# Altium project ADCAN.PrjPCB
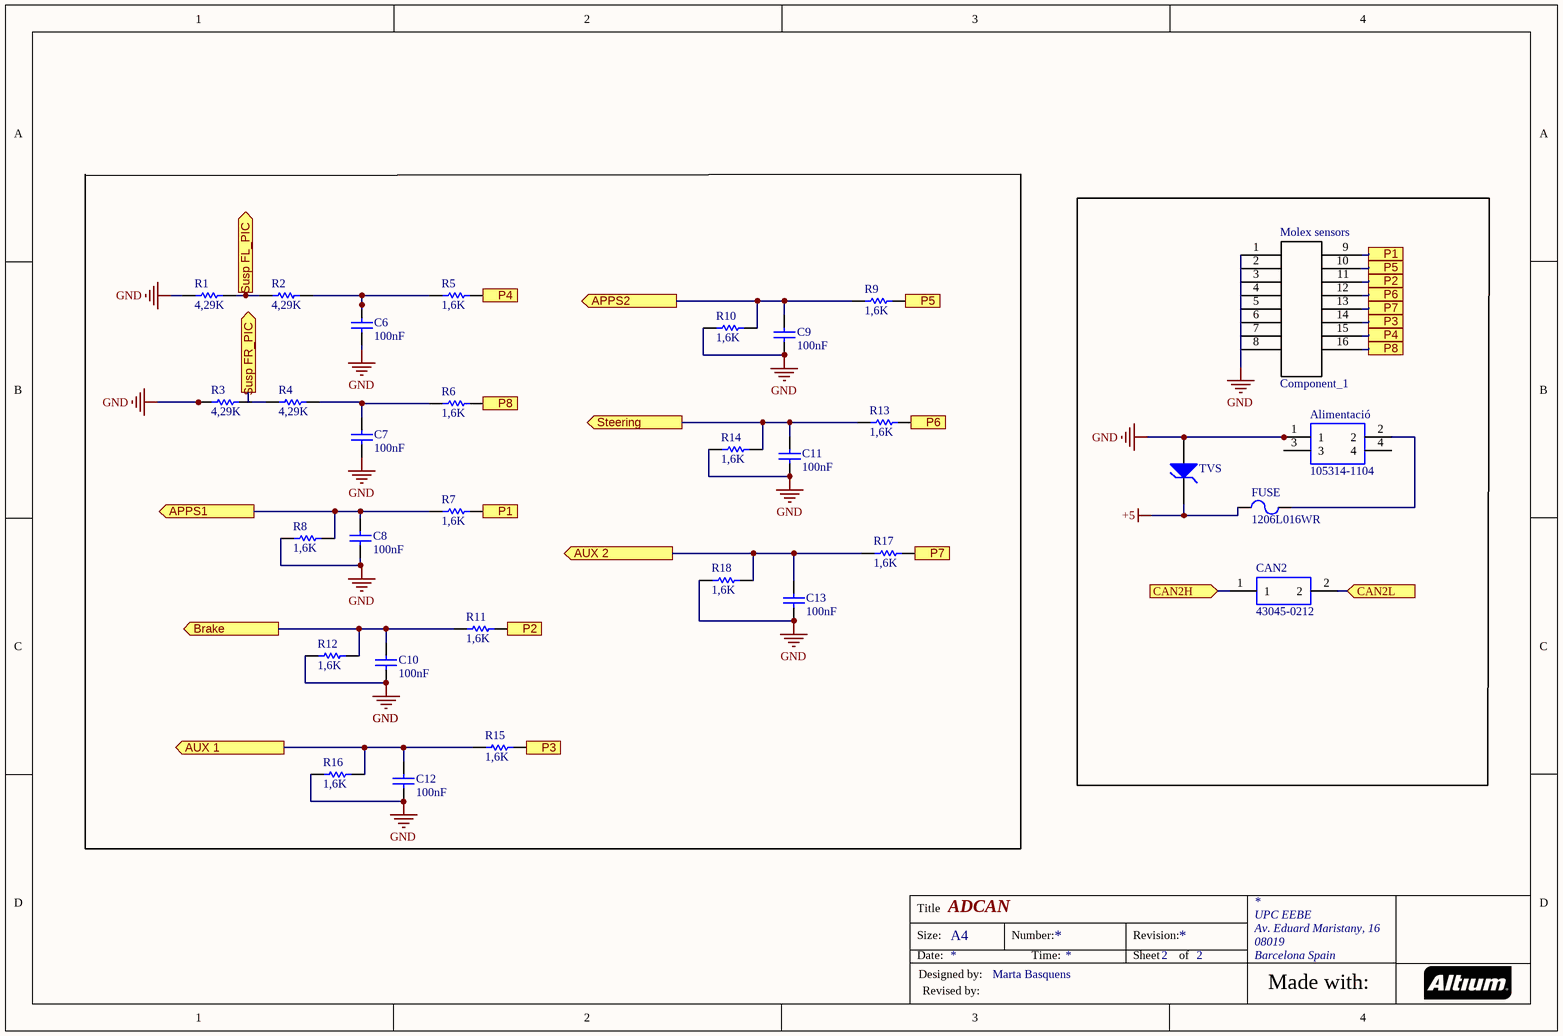
[diagram p0: ADCAN_[sch2].SchDoc]
2 sheets, 50 parts. Net scope: flat (ports and power ports of the same name join across sheets).
Board file: ADCAN.PcbDoc
Sheets:
  ADCAN_[sch2].SchDoc
  ADCAN_[sch1].SchDoc

## Sheet ADCAN_[sch2].SchDoc: ADCAN
size A4; SheetNumber: 2; SheetTotal: 2; University: UPC EEBE; City&Country: Barcelona Spain; Country: NSW; CP: 08019; DesignerName: Marta Basquens; Address: Av. Eduard Maristany, 16

### Parts
Alimentació  105314-1104  [1053141304]
C6  100nF  [CAPC3216X102X94LL20]
C7  100nF  [CAPC3216X102X94LL20]
C8  100nF  [CAPC3216X102X94LL20]
C9  100nF  [CAPC3216X102X94LL20]
C10  100nF  [CAPC3216X102X94LL20]
C11  100nF  [CAPC3216X102X94LL20]
C12  100nF  [CAPC3216X102X94LL20]
C13  100nF  [CAPC3216X102X94LL20]
CAN2  43045-0212  [0430450212]
FUSE  1206L016WR  [LFUS-1206L016WR_V]
Molex_sensors  Component_1  [PCBComponent_1]
R1  4,29K  [RESC1206(3216)_L]
R2  4,29K  [RESC1206(3216)_L]
R3  4,29K  [RESC1206(3216)_L]
R4  4,29K  [RESC1206(3216)_L]
R5  1,6K  [RESC1206(3216)_L]
R6  1,6K  [RESC1206(3216)_L]
R7  1,6K  [RESC1206(3216)_L]
R8  1,6K  [RESC1206(3216)_L]
R9  1,6K  [RESC1206(3216)_L]
R10  1,6K  [RESC1206(3216)_L]
R11  1,6K  [RESC1206(3216)_L]
R12  1,6K  [RESC1206(3216)_L]
R13  1,6K  [RESC1206(3216)_L]
R14  1,6K  [RESC1206(3216)_L]
R15  1,6K  [RESC1206(3216)_L]
R16  1,6K  [RESC1206(3216)_L]
R17  1,6K  [RESC1206(3216)_L]
R18  1,6K  [RESC1206(3216)_L]
TVS  (no value)  [ONSC-SMB-2-403A-03_J_V]

### Ports
APPS1 (out), APPS2 (out), AUX 1 (out), AUX 2 (out), Brake (out), CAN2H (in), CAN2L (in), P1, P2, P3, P4, P5, P6, P7, P8, Steering (out), Susp FL_PIC (out), Susp FR_PIC (out)

### Nets
+5: FUSE.1 TVS.C
GND: Alimentació.1 C6.1 C7.1 C8.1 C9.1 C10.1 C11.1 C12.1 C13.1 R1.1 R3.1 R8.2 R10.2 R12.2 R14.2 R16.2 R18.2 TVS.A
NetAlimentació_2: Alimentació.2 FUSE.2
NetC6_2: C6.2 R2.2 R5.2
NetC7_2: C7.2 R4.2 R6.2
NetC8_2: C8.2 R7.2 R8.1 ; port APPS1
NetC9_2: C9.2 R9.2 R10.1 ; port APPS2
NetC10_2: C10.2 R11.2 R12.1 ; port Brake
NetC11_2: C11.2 R13.2 R14.1 ; port Steering
NetC12_2: C12.2 R15.2 R16.1 ; port AUX 1
NetC13_2: C13.2 R17.2 R18.1 ; port AUX 2
NetCAN2_1: CAN2.1 ; port CAN2H
NetCAN2_2: CAN2.2 ; port CAN2L
NetPIC18F2685_22: R1.2 R2.1 ; port Susp FL_PIC
NetR3_1: R3.1 R4.2
NetR5_1: R5.1 ; port P4
NetR6_1: R6.1 ; port P8
NetR7_1: R7.1 ; port P1
NetR9_1: R9.1 ; port P5
NetR11_1: R11.1 ; port P2
NetR13_1: R13.1 ; port P6
NetR15_1: R15.1 ; port P3
NetR17_1: R17.1 ; port P7

Not connected (* = marked no-connect by the designer): Alimentació 3 4; Molex_sensors 1 2 3 4 5 6 7 8 9 10 11 12 13 14 15 16

### Notes on the sheet
- Title
- Size:
- Date:
- Designed by:
- A4
- Number:
- Time:
- Revision:
- Sheet
- of
- Made with:
- Revised by:

### Library data of the parts
Alimentació = 105314-1104: Molex Nano-Fit 105314, 2.5mm Pitch, 4 Way, 2 Row, Right Angle PCB Header, Through Hole; Geometry.Height: 9.14mm; Manufacturer_Name: Molex; Manufacturer_Part_Number: 105314-1104; RS Part Number: 1623690; RS Price/Stock: http://uk.rs-online.com/web/p/products/1623690; Arrow Part Number: 105314-1104; Arrow Price/Stock: http://uk.rs-online.com/web/p/products/1623690; Datasheet Link: https://www.molex.com/pdm_docs/sd/1053141104_sd.pdf
C6-C13 = CMP-2000-07385-1: Chip Capacitor, 1.05 nF, +/- 12%, 14 V, -55 to 125 degC, 1206 (3216 Metric), RoHS, Tape and Reel; Manufacturer: AVX; Brand/Series: TransGuard®; Current, Reverse, Maximum: 15 / µA; Type: TVS; Standards: ULListed; Capacitance: 1050 / pF; Energy Rating: 0.4 / Joules; Voltage, Working: 14/10 / VDC/VAC; Suppressor Type: Voltage; For Use With: IndustrialEquipment; Temperature, Junction, Maximum: +125 / °C; Configuration: Bidirectional; Current, Ratings: 150 / A; Voltage, Operating: 10/14 / VAC/VDC; Primary Type: Diodes; Voltage, Breakdown: 18.5 / V; Clamping Voltage: 32 / V; Temperature, Junction, Minimum: –55 / °C; Termination: Leadwires; Mounting Type: Thru-Hole; Current, Leakage: 15 / µA; Package Type: 1206; Current, Leakage, Maximum: 15 / µA; Manufacturer URL: http://www.avx.com/; Dimensions: 3.2Lx1.6Wx0.94T / mm; Package Reference: 1206; Datasheet URL: http://datasheets.avx.com/tguard.pdf; Current, Surge: 150 / A; Mounting Technology: SurfaceMount; Voltage, Clamping: 32 / V; Datasheet Version: 08/2016; Package Description: 2-Pin Surface Mount Device, Body 3.2 x 1.6 mm
CAN2 = 43045-0212: 2 way 2 row vertical header,3mm pitch Molex MICRO-FIT 3.0 Series, Series Number 43045, 3mm Pitch 2 Way 2 Row Shrouded Straight PCB Header, Through Hole; Allied_Number: 70090950; Manufacturer_Name: Molex; Manufacturer_Part_Number: 43045-0212; RS Part Number: 2332860P; RS Price/Stock: http://uk.rs-online.com/web/p/products/2332860P; Allied Price/Stock: https://www.alliedelec.com/molex-incorporated-43045-0212/70090950/; Arrow Part Number: 43045-0212; Arrow Price/Stock: http://uk.rs-online.com/web/p/products/2332860P; Datasheet Link: http://www.mouser.com/ds/2/276/0430450212_PCB_HEADERS-142866.pdf
FUSE = CMP-2000-05471-1: Resettable Fuse, 30 V, 100 A, 4.5 Ohm, -40 to 85 degC, 1206 (3216 Metric), RoHS, Tape and Reel; Manufacturer: Littelfuse; Hold Current [Ih]: 0.16A; Trip Current: 0.37A; Working Voltage-Max: 30V; Datasheet Version: 08/2016; Size: 1206; Manufacturer URL: http://www.littelfuse.com/; Datasheet URL: http://www.littelfuse.com/~/media/electronics/datasheets/resettable_ptcs/littelfuse_ptc_1206l_datasheet.pdf.pdf; Mounting Technology: SurfaceMount; Package Reference: 1206L016WR; Package Description: 2-Pin Surface Mount Device, Body 3.2 x 1.65 mm, Height 1.45 mm (Max); Operating Temp Range: -40to+85°C
R1-R18 = CMP-1014-00659-1: 22K 0.25W 1% 1206 (3216 Metric)  SMD; Value: 22000.00 Ohm; Case-EIA: 1206; Case-Metric: 3216; Technology: SMT; Tolerance: 1 %; Power: 0.25 W
TVS = CMP-1679-00003-1: TVS ZENER UNIDIR 600W 27V SMB; PartNumber: P6SMB27AT3G; PackageReference: SMB-2-403A-03_J; ComponentLink1URL: http://www.onsemi.com/pub_link/Collateral/P6SMB6.8AT3-D.PDF; ComponentLink1Description: Datasheet

## Sheet ADCAN_[sch1].SchDoc: ADCAN
size A4; Author: Marta Basquens; SheetNumber: 1; SheetTotal: 2; University: UPC EEBE; City&Country: Barcelona Spain; Country: NSW; CP: 08019; DesignerName: Marta Basquens; Address: Av. Eduard Maristany, 16
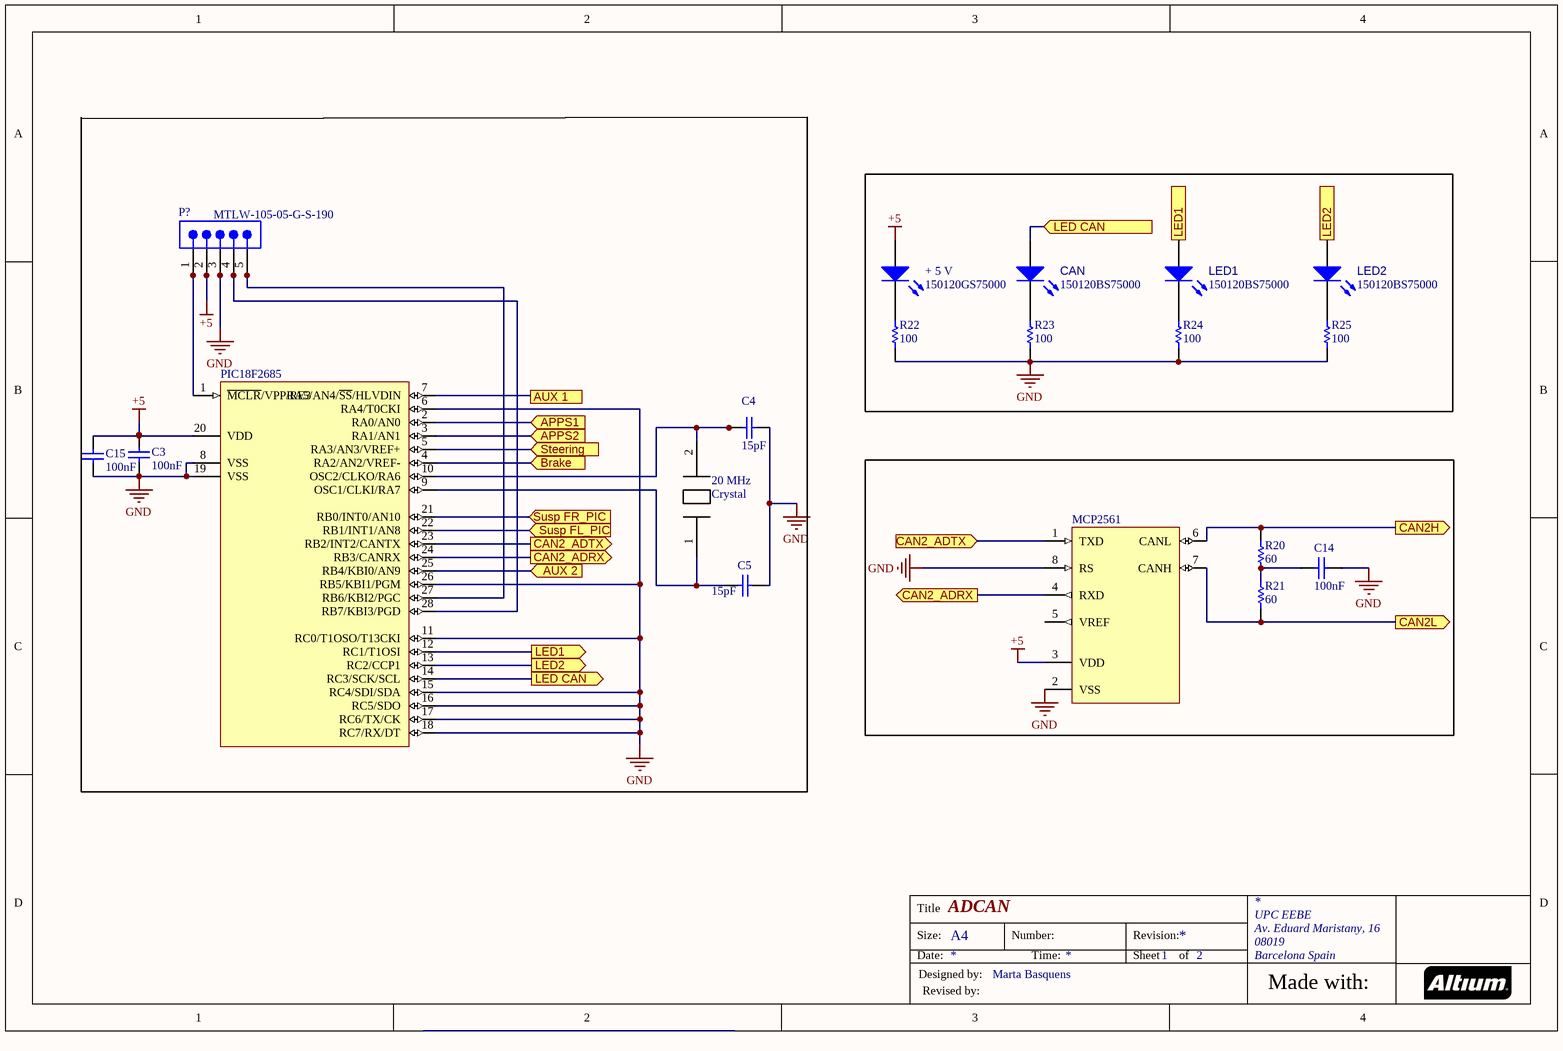
[diagram p1: ADCAN_[sch1].SchDoc]

### Parts
20_MHz  Crystal  [Crystal]
+_5_V  150120GS75000  [1206_A]
C3  100nF  [CAPC3216X102X94LL20]
C4  15pF  [CAPC1206(3216)100_L]
C5  15pF  [CAPC1206(3216)100_L]
C14  100nF  [CAPC3216X102X94LL20]
C15  100nF  [CAPC3216X102X94LL20]
CAN  150120BS75000  [1206_A]
LED1  150120BS75000  [1206_A]
LED2  150120BS75000  [1206_A]
MCP2561  (no value)  [SOIC-SN8_N]
P?  MTLW-105-05-G-S-190  [SMTC-MTLW-105-05-X-S-190]
PIC18F2685  (no value)  [SOIC-SO28_M]
R20  60  [RESC1206(3216)_L]
R21  60  [RESC1206(3216)_L]
R22  100  [RESC1206(3216)_L]
R23  100  [RESC1206(3216)_L]
R24  100  [RESC1206(3216)_L]
R25  100  [RESC1206(3216)_L]

### Ports
APPS1 (in), APPS2 (in), AUX 1 (in), AUX 2 (in), Brake (in), CAN2_ADRX (out), CAN2_ADTX (in), CAN2_ADTX (out), CAN2H (out), CAN2L (out), LED1 (in), LED1 (out), LED2 (in), LED2 (out), LED CAN (in), LED CAN (out), Steering (in), Susp FL_PIC (in), Susp FR_PIC (in)

### Nets
+5: +_5_V.2(A) C3.2 C15.2 MCP2561.3(VDD) P?.2 PIC18F2685.20(VDD)
GND: C4.2 C5.2 C14.2 C15.1 MCP2561.2(VSS) MCP2561.8(RS) P?.3 PIC18F2685.6(RA4/T0CKI) PIC18F2685.8(VSS) PIC18F2685.11(RC0/T1OSO/T13CKI) PIC18F2685.15(RC4/SDI/SDA) PIC18F2685.16(RC5/SDO) PIC18F2685.17(RC6/TX/CK) PIC18F2685.18(RC7/RX/DT) PIC18F2685.19(VSS) PIC18F2685.26(RB5/KBI1/PGM) R22.1 R23.1 R24.1 R25.1
Net+_5_V_1: +_5_V.1(K) R22.2
NetC4_1: C4.1 PIC18F2685.10(OSC2/CLKO/RA6)
NetC5_1: C5.1 PIC18F2685.9(OSC1/CLKI/RA7)
NetC8_2: PIC18F2685.2(RA0/AN0) ; port APPS1
NetC9_2: PIC18F2685.3(RA1/AN1) ; port APPS2
NetC10_2: PIC18F2685.4(RA2/AN2/VREF-) ; port Brake
NetC11_2: PIC18F2685.5(RA3/AN3/VREF+) ; port Steering
NetC13_2: PIC18F2685.25(RB4/KBI0/AN9) ; port AUX 2
NetC14_1: C14.1 R20.1 R21.2
NetCAN2_1: MCP2561.6(CANL) R20.2 ; port CAN2H
NetCAN2_2: MCP2561.7(CANH) R21.1 ; port CAN2L
NetCAN_1: CAN.1(K) R23.2
NetCAN_2: CAN.2(A) PIC18F2685.14(RC3/SCK/SCL) ; port LED CAN
NetLED1_1: LED1.1(K) R24.2
NetLED1_2: LED1.2(A) PIC18F2685.12(RC1/T1OSI) ; port LED1
NetLED2_1: LED2.1(K) R25.2
NetLED2_2: LED2.2(A) PIC18F2685.13(RC2/CCP1) ; port LED2
NetMCP2561_1: MCP2561.1(TXD) PIC18F2685.23(RB2/INT2/CANTX) ; port CAN2_ADTX
NetMCP2561_4: MCP2561.4(RXD) PIC18F2685.24(RB3/CANRX) ; port CAN2_ADRX
NetP?_1: P?.1 PIC18F2685.1(~{MCLR}/VPP/RE3)
NetP?_4: P?.4 PIC18F2685.28(RB7/KBI3/PGD)
NetP?_5: P?.5 PIC18F2685.27(RB6/KBI2/PGC)
NetPIC18F2685_21: PIC18F2685.21(RB0/INT0/AN10) ; port Susp FR_PIC
NetPIC18F2685_22: PIC18F2685.22(RB1/INT1/AN8) ; port Susp FL_PIC

Not connected (* = marked no-connect by the designer): 20_MHz 1 2; C3 1; MCP2561 5(VREF); PIC18F2685 7(RA5/AN4/~{SS}/HLVDIN)

### Notes on the sheet
- Title
- Size:
- Date:
- Designed by:
- A4
- Number:
- Time:
- Revision:
- Sheet
- of
- Made with:
- Revised by:

### Library data of the parts
+_5_V = CMP-1426-00014-1: SMD mono-color Chip LED, WL-SMCW, Green; Manufacturer: Wuerth Elektronik; PackageReference: 1206_A; PartNumber: 150120GS75000; ComponentLink1Description: Manufacturer URL; ComponentLink2URL: http://katalog.we-online.com/led/datasheet/150120GS75000.pdf; ComponentLink2Description: Datasheet; Color: Green; ComponentLink1URL: http://www.we-online.com
C3 C14 C15 = CMP-2000-07385-1: as C6 on sheet ADCAN_[sch2]; Termination: Leadwires; Mounting Type: Thru-Hole; Current, Leakage: 15 / µA; Package Type: 1206; Current, Leakage, Maximum: 15 / µA; Manufacturer URL: http://www.avx.com/; Dimensions: 3.2Lx1.6Wx0.94T / mm; Package Reference: 1206; Datasheet URL: http://datasheets.avx.com/tguard.pdf; Current, Surge: 150 / A; Mounting Technology: SurfaceMount; Voltage, Clamping: 32 / V; Datasheet Version: 08/2016; Package Description: 2-Pin Surface Mount Device, Body 3.2 x 1.6 mm
C4 C5 = CMP-1037-00790-1: CAP 15pF 16V ±10% 1206 (3216 Metric) Thickness 1mm SMD; Tolerance: Â±10%; Case-Metric: 3216; Case-EIA: 1206; Technology: SMT; Rated Voltage: 16 V; Value: 15pF; Max Thickness: 1 mm
CAN LED1 LED2 = CMP-1426-00015-1: SMD mono-color Chip LED, WL-SMCW, Blue; Manufacturer: Wuerth Elektronik; ComponentLink2Description: Datasheet; ComponentLink1URL: http://www.we-online.com; PartNumber: 150120BS75000; ComponentLink1Description: Manufacturer URL; ComponentLink2URL: http://katalog.we-online.com/led/datasheet/150120BS75000.pdf; PackageReference: 1206_A; Color: Blue
MCP2561 = CMP-0186-00138-2: High-Speed CAN Transceiver, 8-Pin SOIC, Industrial Temperature; Code_JEDEC: MS-012; ComponentLink3URL: http://www.microchip.com/stellent/groups/techpub_sg/documents/packagingspec/en012702.pdf; DatasheetVersion: revF, Jul-2010; PackageVersion: revBB, Aug-2009; PackageDescription: 8-Lead Plastic Small Outline (SN) - Narrow, 3.90mm Body [SOIC]; ComponentLink1URL: http://www.microchip.com/; ComponentLink3Description: Package Specification; ComponentLink2Description: Datasheet; Code_IPC: SOIC127P600-8; ComponentLink1Description: Manufacturer URL; PackageReference: SOIC-SN8; ComponentLink2URL: http://ww1.microchip.com/downloads/en/DeviceDoc/21667F.pdf; RevisionNote: URLs added. DatasheetVersion updated.
P? = CMP-1024-00076-1: Manufacturer: Samtec; Pitch: 2.54 mm; ComponentLink3Description: Package Specification; ComponentLink1Description: Manufacturer URL; ComponentLink1URL: http://www.samtec.com; PartNumber: MTLW-105-05-G-S-190; Mounting Technology: Through-hole; Orientation: Vertical; ComponentLink3URL: http://www.samtec.com/documents/webfiles/cpdf/MTLW-1XX-XX-XX-X-XXX-XX-XX-MKT1.pdf; PackageReference: MTLW-105-05-X-S-190; ComponentLink2URL: http://www.samtec.com/documents/webfiles/pdf/MTLW_TH.PDF; ComponentLink2Description: Datasheet; PackageDescription: Low Profile Terminal Assembly; Temperature Range: -55 to 125 degC; DatasheetVersion: F-214; RoHS: True; PackageVersion: T, 6/1991
PIC18F2685 = CMP-0116-01073-1: Enhanced Flash Microcontroller with ECAN Technology, 10-Bit A/D and nanoWatt Technology, 96K Flash, 28-Pin SOIC, Extended Temperature Range, Tape and Reel; ComponentAvailability: Unknown. Contact manufacturer to determine status.; PackageDescription: 28-Lead Plastic Small Outline (SO) - Wide 7.50mm Body [SOIC]; DatasheetVersion: revC, Oct-2009; PackageVersion: revBB, Aug-2009; Code_JEDEC: MS-013; PackageReference: SOIC-SO28
R20 R21 = CMP-1014-00532-1: 1K62 0.25W 1% 1206 (3216 Metric)  SMD; Case-Metric: 3216; Value: 1620.00 Ohm; Case-EIA: 1206; Technology: SMT; Power: 0.25 W; Tolerance: 1 %
R22-R25 = CMP-1014-00659-1: as R1 on sheet ADCAN_[sch2]; Technology: SMT; Tolerance: 1 %; Power: 0.25 W

## Nets that join several sheets
+5: ADCAN_[sch2] (FUSE.1 TVS.C), ADCAN_[sch1] (6 pins)
GND: ADCAN_[sch2] (18 pins), ADCAN_[sch1] (20 pins)
NetC8_2: ADCAN_[sch2] (C8.2 R7.2 R8.1), ADCAN_[sch1] (PIC18F2685.2)
NetC9_2: ADCAN_[sch2] (C9.2 R9.2 R10.1), ADCAN_[sch1] (PIC18F2685.3)
NetC10_2: ADCAN_[sch2] (C10.2 R11.2 R12.1), ADCAN_[sch1] (PIC18F2685.4)
NetC11_2: ADCAN_[sch2] (C11.2 R13.2 R14.1), ADCAN_[sch1] (PIC18F2685.5)
NetC13_2: ADCAN_[sch2] (C13.2 R17.2 R18.1), ADCAN_[sch1] (PIC18F2685.25)
NetCAN2_1: ADCAN_[sch2] (CAN2.1), ADCAN_[sch1] (MCP2561.6 R20.2)
NetCAN2_2: ADCAN_[sch2] (CAN2.2), ADCAN_[sch1] (MCP2561.7 R21.1)
NetPIC18F2685_22: ADCAN_[sch2] (R1.2 R2.1), ADCAN_[sch1] (PIC18F2685.22)